# Altium schematic sheet ESP.SchDoc
size A4; SheetNumber: 1; SheetTotal: 3
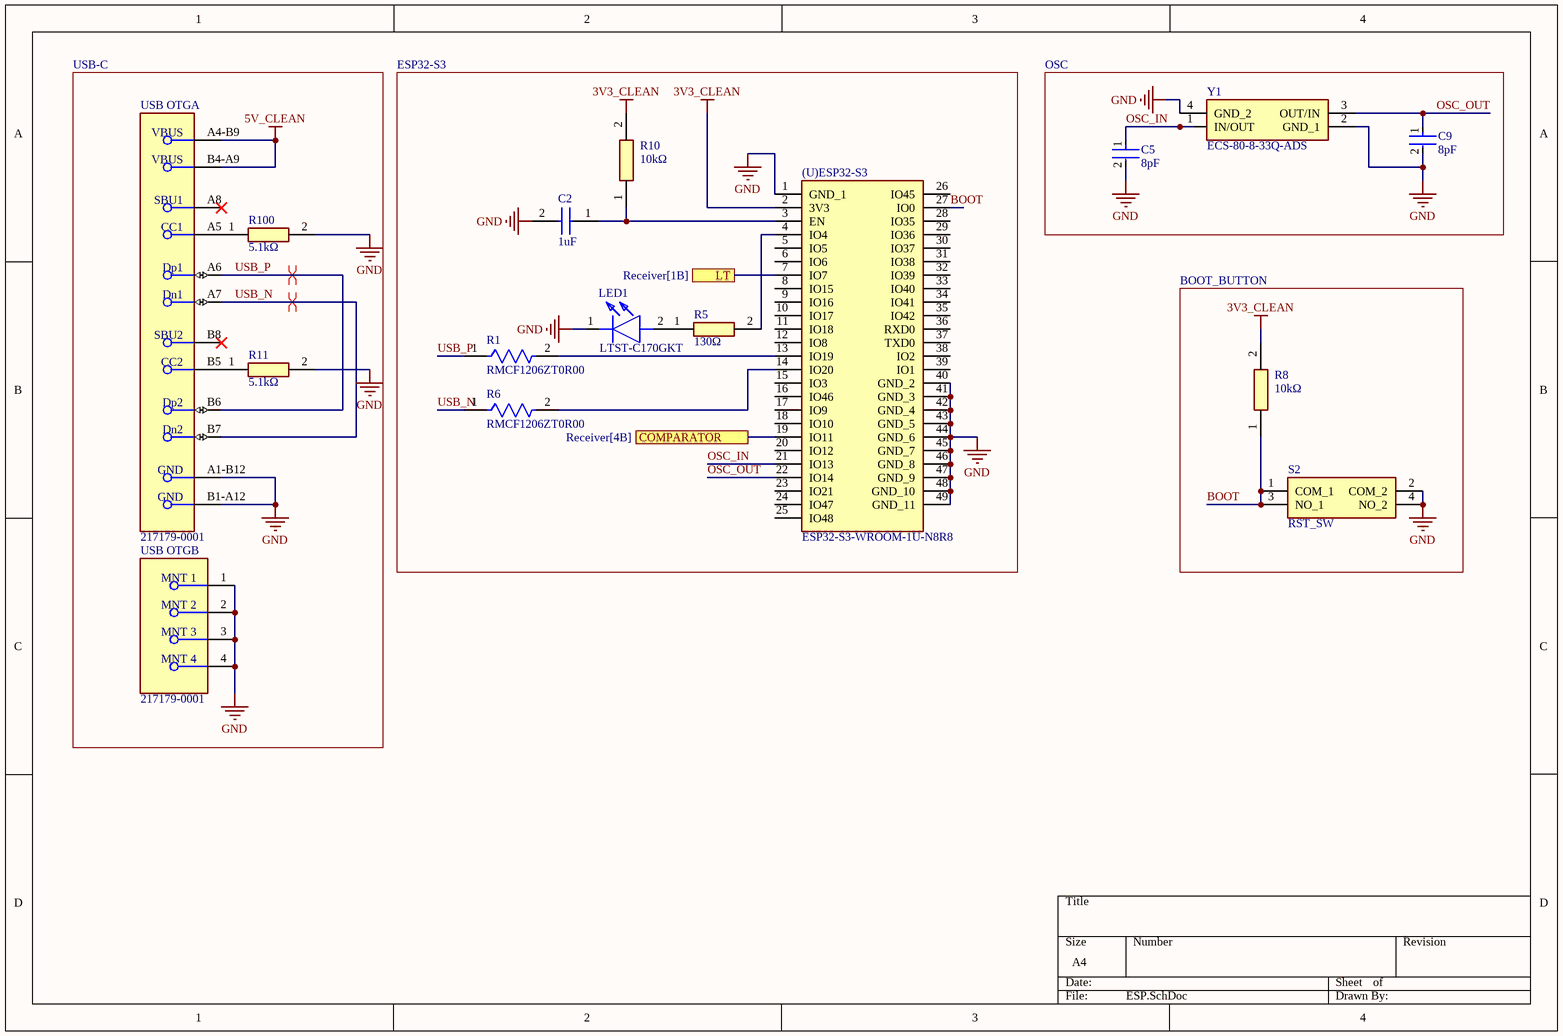
[diagram p0: ESP.SchDoc]

## Parts
(U)ESP32-S3  ESP32-S3-WROOM-1U-N8R8  [ESP32S3WROOM1UN8R8]
C2  1uF  [CAPC1608X90N]
C5  8pF  [FP-CGA3E-0_3-0_1-IPC_A]
C9  8pF  [FP-CGA3E-0_3-0_1-IPC_A]
LED1  LTST-C170GKT  [LEDC2012X120N]
R1  RMCF1206ZT0R00  [FP-RMCF1206-MFG]
R5  130Ω  [RESC1608X55N]
R6  RMCF1206ZT0R00  [FP-RMCF1206-MFG]
R8  10kΩ  [RESC1608X55N]
R10  10kΩ  [RESC1608X55N]
R11  5.1kΩ  [RESC1608X55N]
R100  5.1kΩ  [RESC1608X55N]
S2  RST_SW  [18259106]
USB_OTG  217179-0001  [FP-2171790001-MFG]  (parts A,B of 2)
Y1  ECS-80-8-33Q-ADS  [ECS80833QADS]

## Blocks framed on the sheet
USB-C: R11 R100 USB_OTG
ESP32-S3: (U)ESP32-S3 C2 LED1 R1 R5 R6 R10
OSC: C5 C9 Y1
BOOT_BUTTON: R8 S2

## Ports
COMPARATOR (see Receiver[4B]), LT (see Receiver[1B])

## Nets
3V3_CLEAN: (U)ESP32-S3.2(3V3) R8.2 R10.2
5V_CLEAN: USB_OTG.A4-B9(VBUS) USB_OTG.B4-A9(VBUS)
GND: (U)ESP32-S3.1(GND_1) (U)ESP32-S3.40(GND_2) (U)ESP32-S3.41(GND_3) (U)ESP32-S3.42(GND_4) (U)ESP32-S3.43(GND_5) (U)ESP32-S3.44(GND_6) (U)ESP32-S3.45(GND_7) (U)ESP32-S3.46(GND_8) (U)ESP32-S3.47(GND_9) (U)ESP32-S3.48(GND_10) (U)ESP32-S3.49(GND_11) C2.2 C5.2 C9.2 LED1.1(K) R11.2 R100.2 S2.2(COM_2) S2.4(NO_2) USB_OTG.1(MNT_1) USB_OTG.2(MNT_2) USB_OTG.3(MNT_3) USB_OTG.4(MNT_4) USB_OTG.A1-B12(GND) USB_OTG.B1-A12(GND) Y1.2(GND_1) Y1.4(GND_2)
BOOT: (U)ESP32-S3.27(IO0) R8.1 S2.1(COM_1) S2.3(NO_1)
COMPARATOR: (U)ESP32-S3.19(IO11) ; port COMPARATOR
LT: (U)ESP32-S3.7(IO7) ; port LT
OSC_IN: (U)ESP32-S3.21(IO13) C5.1 Y1.1(IN/OUT)
OSC_OUT: (U)ESP32-S3.22(IO14) C9.1 Y1.3(OUT/IN)
USB_N: R6.1 USB_OTG.A7(Dn1) USB_OTG.B7(Dn2)
USB_P: R1.1 USB_OTG.A6(Dp1) USB_OTG.B6(Dp2)
Net(U)ESP32-S3_3: (U)ESP32-S3.3(EN) C2.1 R10.1
Net(U)ESP32-S3_4: (U)ESP32-S3.4(IO4) R5.2
Net(U)ESP32-S3_13: (U)ESP32-S3.13(IO19) R1.2
Net(U)ESP32-S3_14: (U)ESP32-S3.14(IO20) R6.2
NetLED1_2: LED1.2(A) R5.1
NetR11_1: R11.1 USB_OTG.B5(CC2)
NetR100_1: R100.1 USB_OTG.A5(CC1)

Not connected (* = marked no-connect by the designer): (U)ESP32-S3 5(IO5) 6(IO6) 8(IO15) 9(IO16) 10(IO17) 11(IO18) 12(IO8) 15(IO3) 16(IO46) 17(IO9) 18(IO10) 20(IO12) 23(IO21) 24(IO47) 25(IO48) 26(IO45) 28(IO35) 29(IO36) 30(IO37) 31(IO38) 32(IO39) 33(IO40) 34(IO41) 35(IO42) 36(RXD0) 37(TXD0) 38(IO2) 39(IO1); USB_OTG A8(SBU1)* B8(SBU2)*

## Layout directives
differential pair: USB_N, USB_P

## Library data of the parts
(U)ESP32-S3 = ESP32-S3-WROOM-1U-N8R8: Integrated Circuit; Manufacturer_Name: Espressif Systems; Datasheet Link: https://www.espressif.com/sites/default/files/documentation/esp32-s3-wroom-1_wroom-1u_datasheet_en.pdf; Height: 3.35mm; Manufacturer_Part_Number: ESP32-S3-WROOM-1U-N8R8; Mouser Part Number: 356-ESP32S3WRM1UN8R8; Mouser Price/Stock: https://www.mouser.co.uk/ProductDetail/Espressif-Systems/ESP32-S3-WROOM-1U-N8R8?qs=Li%252BoUPsLEnvOglIa3CypaQ%3D%3D
C2 = CL10B105KP8NNNC: Capacitor; Manufacturer_Name: SAMSUNG; Datasheet Link: https://media.digikey.com/pdf/Data%20Sheets/Samsung%20PDFs/CL_Series_MLCC_ds.pdf; Height: 0.9mm; Manufacturer_Part_Number: CL10B105KP8NNNC; Mouser Part Number: 187-CL10B105KP8NNNC; Mouser Price/Stock: https://www.mouser.co.uk/ProductDetail/Samsung-Electro-Mechanics/CL10B105KP8NNNC?qs=X6jEic%2FHinD9krOsbkFZow%3D%3D; Arrow Part Number: CL10B105KP8NNNC; Arrow Price/Stock: https://www.arrow.com/en/products/cl10b105kp8nnnc/samsung-electro-mechanics?utm_currency=USD&region=nac
C5 C9 = CMP-08246-000516-1: Cap Ceramic 8pF 50V C0G 0.5pF Pad SMD 0603 +125°C Automotive T/R; Length: 1.6mm; Max Operating Temperature: 125°C; Voltage Rating: 50V; Depth: 0.8mm; Height: 0.8mm; Composition: Ceramic; Package Quantity: 4000; Thickness: 0.035inch; Packaging: Tape and Reel; Weight: 7.1E-05oz; Mount: Surface Mount; Ratings: AEC-Q200; Width: 0.031inch; Voltage Rating (DC): 50V; Termination: SMD/SMT; Case Code (Metric): 1608; Case Code (Imperial): 0603; Capacitance: 8pF; Min Operating Temperature: -55°C; Dielectric: C0G; Case/Package: 0603; Radiation Hardening: No; REACH SVHC: No SVHC
LED1 = LTST-C170GKT: LED; Manufacturer_Name: Lite-On; Datasheet Link: https://mm.digikey.com/Volume0/opasdata/d220001/medias/docus/895/LTST-C170GKT.pdf; Height: 1.2mm; Manufacturer_Part_Number: LTST-C170GKT; Mouser Part Number: 859-LTST-C170GKT; Mouser Price/Stock: https://www.mouser.co.uk/ProductDetail/LITEON/LTST-C170GKT?qs=%2FSqKn2EfXQSV5aRij3YIfQ%3D%3D; Arrow Part Number: LTST-C170GKT; Arrow Price/Stock: https://www.arrow.com/en/products/ltst-c170gkt/lite-on-technology?utm_currency=USD&region=europe
R1 R6 = CMP-26527-005649-1: 0Ω ±0 0.25W 1206 Thick Film Chip Resistor AEC-Q200 compliant; Working Voltage: 200V; Power Rating: 250mW; Current Rating: 2A; Resistance: 0R; Construction: Rectangular; RoHS Compliant: Yes; Military Standard: Not; Radiation Hardening: No; Case/Package: 1206; Case Code (Imperial): 1206; Packaging: Tape and Reel; Resistor Type: Thick Film; Mount: Surface Mount; Lead Free: Lead Free; Case Code (Metric): 3216; Width: 0.063inch; Series: RMCF; Features: Automotive AEC-Q200; Number of Terminations: 2; Min Operating Temperature: -55°C; Max Power Dissipation: 250mW; Contact Plating: Tin; Length: 0.126inch; Height: 0.028inch; Technology: THICK FILM; Max Operating Temperature: 155°C; Depth: 1.6mm
R5 = RC0603FR-07130RL: Resistor; Manufacturer_Name: YAGEO; Datasheet Link: https://www.mouser.com/catalog/specsheets/YAGEO_PYu_RC_Group_51_RoHS_L_12.pdf; Height: 0.55mm; Manufacturer_Part_Number: RC0603FR-07130RL
R8 R10 = RC0603FR0710KL: Resistor; Manufacturer_Name: KEMET; Datasheet Link: http://www.yageo.com/documents/recent/PYu-RC0603_51_RoHS_L_v5.pdf; Height: 0.55mm; Manufacturer_Part_Number: RC0603FR0710KL; Arrow Part Number: RC0603FR0710KL; Arrow Price/Stock: https://www.arrow.com/en/products/rc0603fr-0710kl/yageo
R11 R100 = RC0603FR-075K1L: Resistor; Manufacturer_Name: KEMET; Datasheet Link: http://www.yageo.com/documents/recent/PYu-RC0603_51_RoHS_L_v5.pdf; Height: 0.55mm; Manufacturer_Part_Number: RC0603FR-075K1L; Mouser Part Number: 603-RC0603FR-075K1L; Mouser Price/Stock: https://www.mouser.co.uk/ProductDetail/YAGEO/RC0603FR-075K1L?qs=gt6vzsuosg2jUUwxnI2PJQ%3D%3D; Arrow Part Number: RC0603FR-075K1L; Arrow Price/Stock: https://www.arrow.com/en/products/rc0603fr-075k1l/yageo?region=nac
S2 = 1825910-6: Switch; Manufacturer_Name: TE Connectivity; Datasheet Link: https://www.te.com/commerce/DocumentDelivery/DDEController?Action=srchrtrv&DocNm=1308111-1_SWITCHES_CORE_PROGRAM_CATALOG&DocType=Catalog%20Section&DocLang=English&PartCntxt=1825910-6&DocFormat=pdf; Height: 5.3mm; Manufacturer_Part_Number: 1825910-6; Mouser Part Number: 650-1825910-6; Mouser Price/Stock: https://www.mouser.co.uk/ProductDetail/TE-Connectivity/1825910-6?qs=A6cQTCBcXncisYDS1KbpGA%3D%3D; Arrow Part Number: 1825910-6; Arrow Price/Stock: https://www.arrow.com/en/products/1825910-6/te-connectivity?utm_currency=USD&region=europe
USB_OTG = CMP-04767-000028-2: CONN RCP USB2.0 TYP C 24P SMD RA; NexarPartId: 117190526; Gender: Receptacle; Number of Contacts: 16; Current Rating: 1.25A; Voltage Rating: 30V; Min Operating Temperature: -40°C; USB Standard: USB 2.0; Height: 3.36mm; Contact Material: Gold, Nickel; Max Operating Temperature: 85°C
Y1 = ECS-80-8-33Q-ADS: Crystal or Oscillator; Manufacturer_Name: ECS; Datasheet Link: https://ecsxtal.com/store/pdf/ECX-33Q.pdf; Height: 0.8mm; Manufacturer_Part_Number: ECS-80-8-33Q-ADS; Mouser Part Number: 520-ECS-80-8-33Q-ADS; Mouser Price/Stock: https://www.mouser.co.uk/ProductDetail/ECS/ECS-80-8-33Q-ADS?qs=hWgE7mdIu5RnrjF6MxWwaQ%3D%3D; Arrow Part Number: ECS-80-8-33Q-ADS; Arrow Price/Stock: https://www.arrow.com/en/products/ecs-80-8-33q-ads/ecs-international?region=nac